# EAGLE board F6779 Ver 2.1 (EAGLE 7.7.0), part 1 of 2
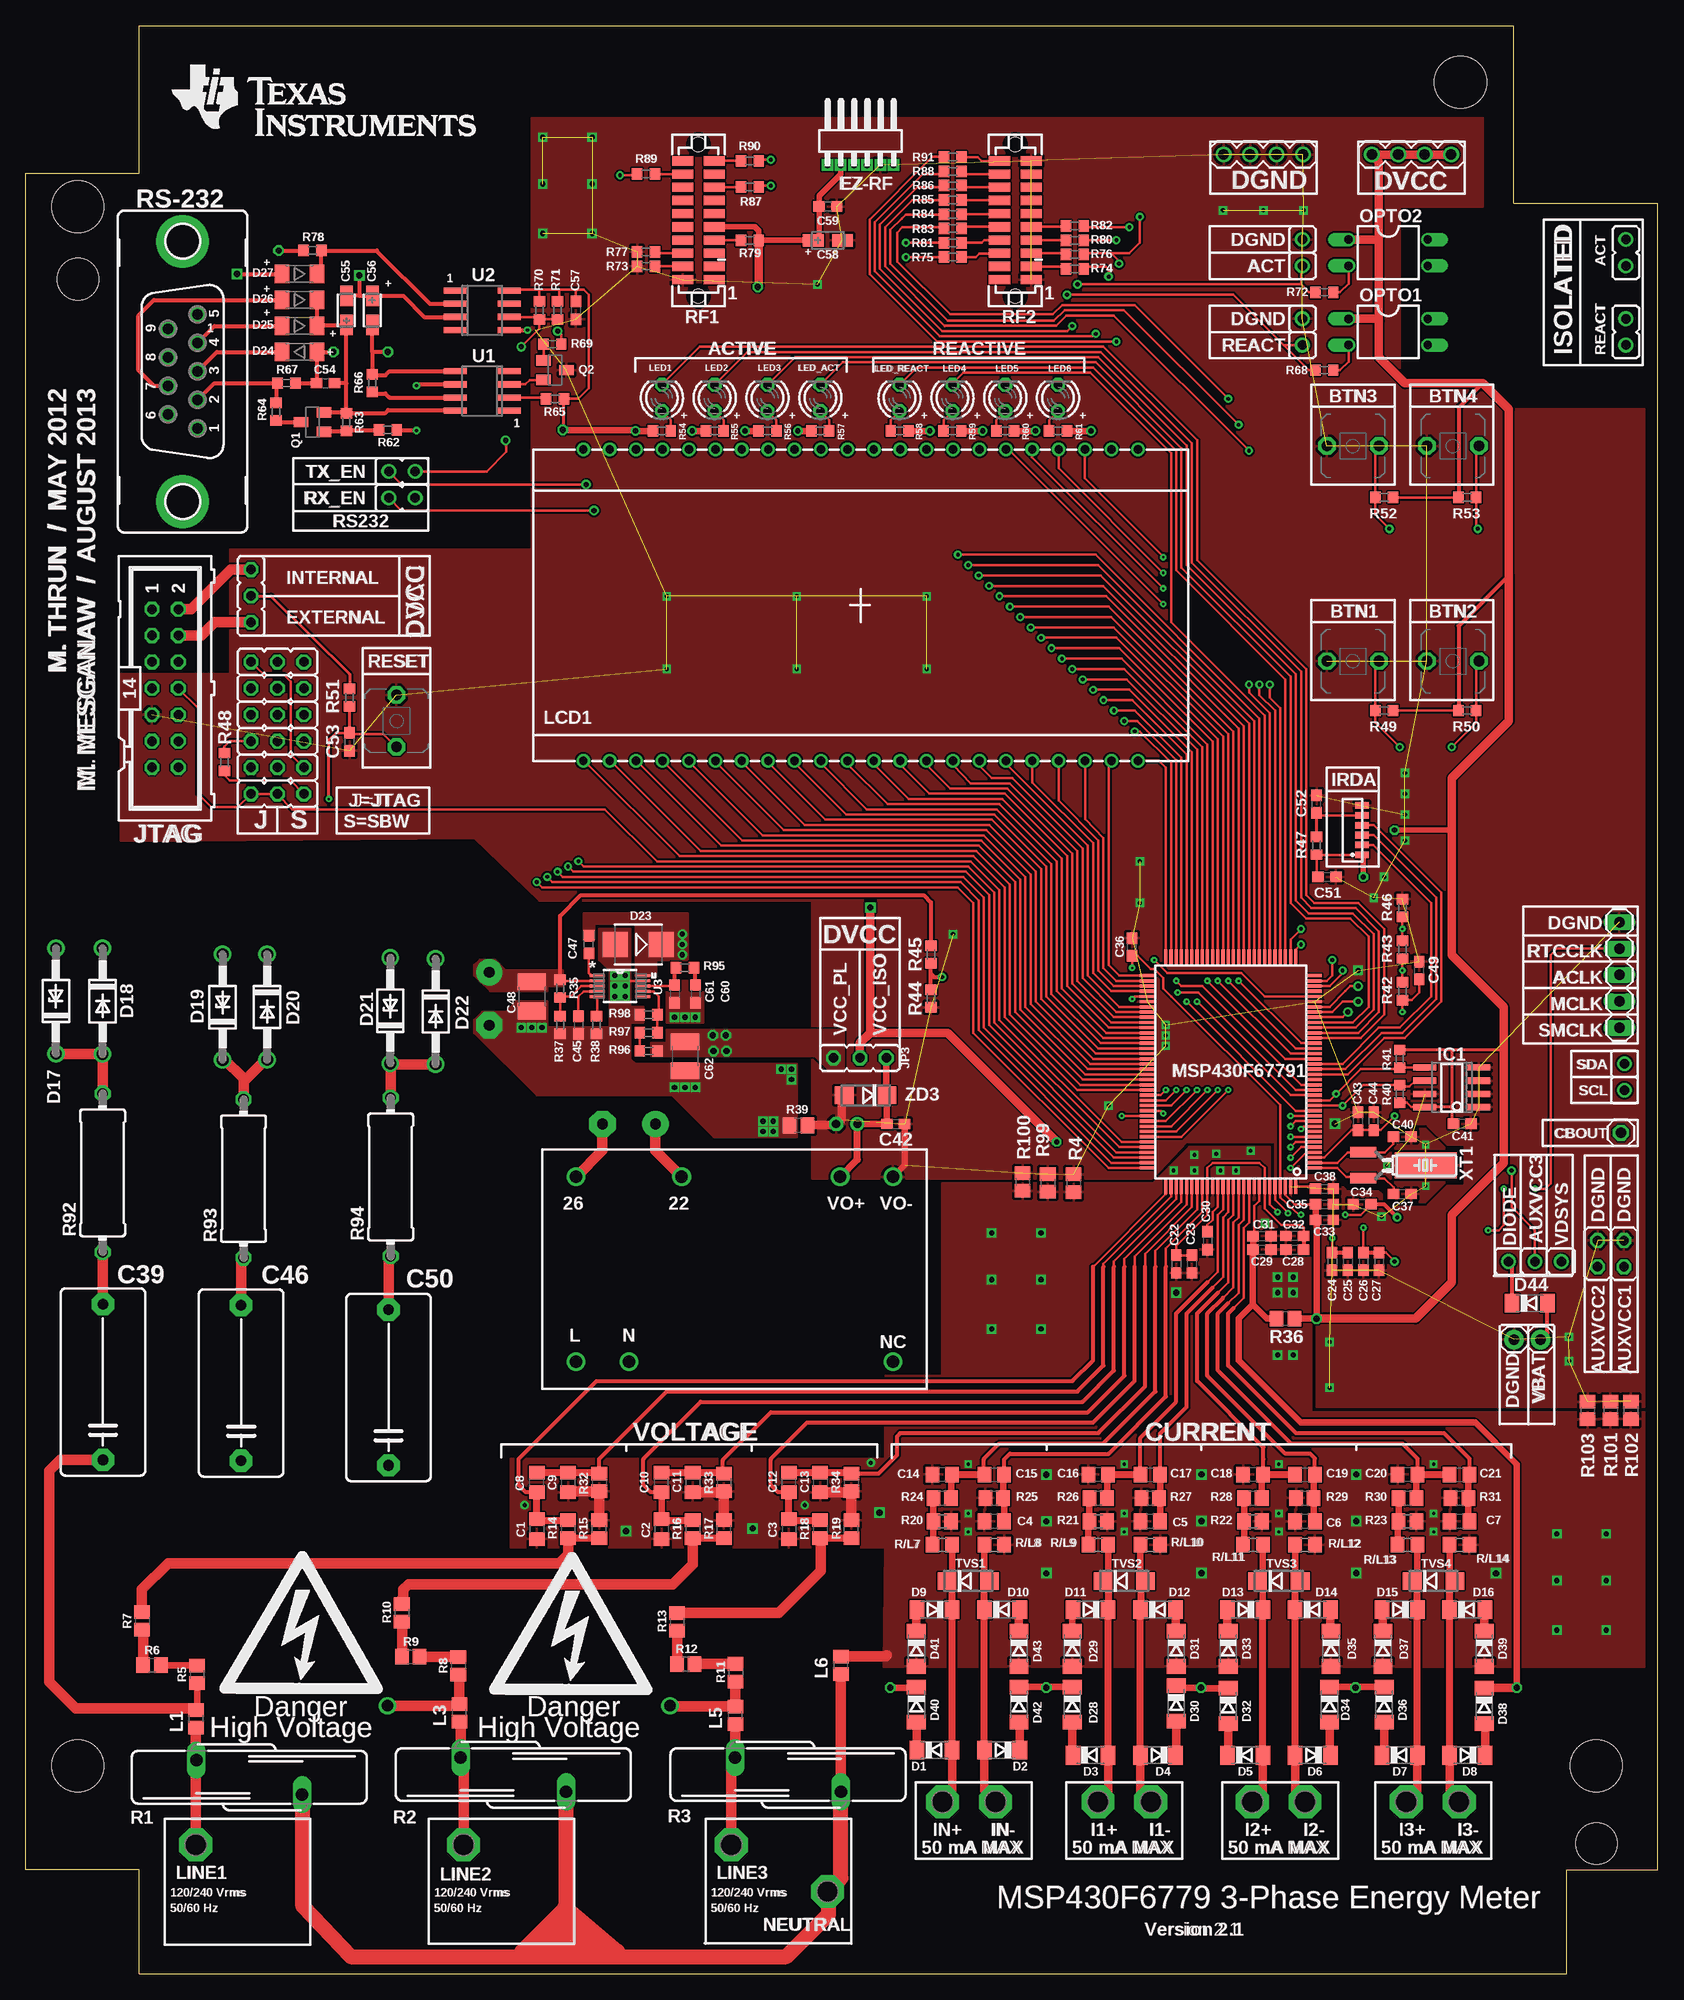
[diagram p4: board, top side]
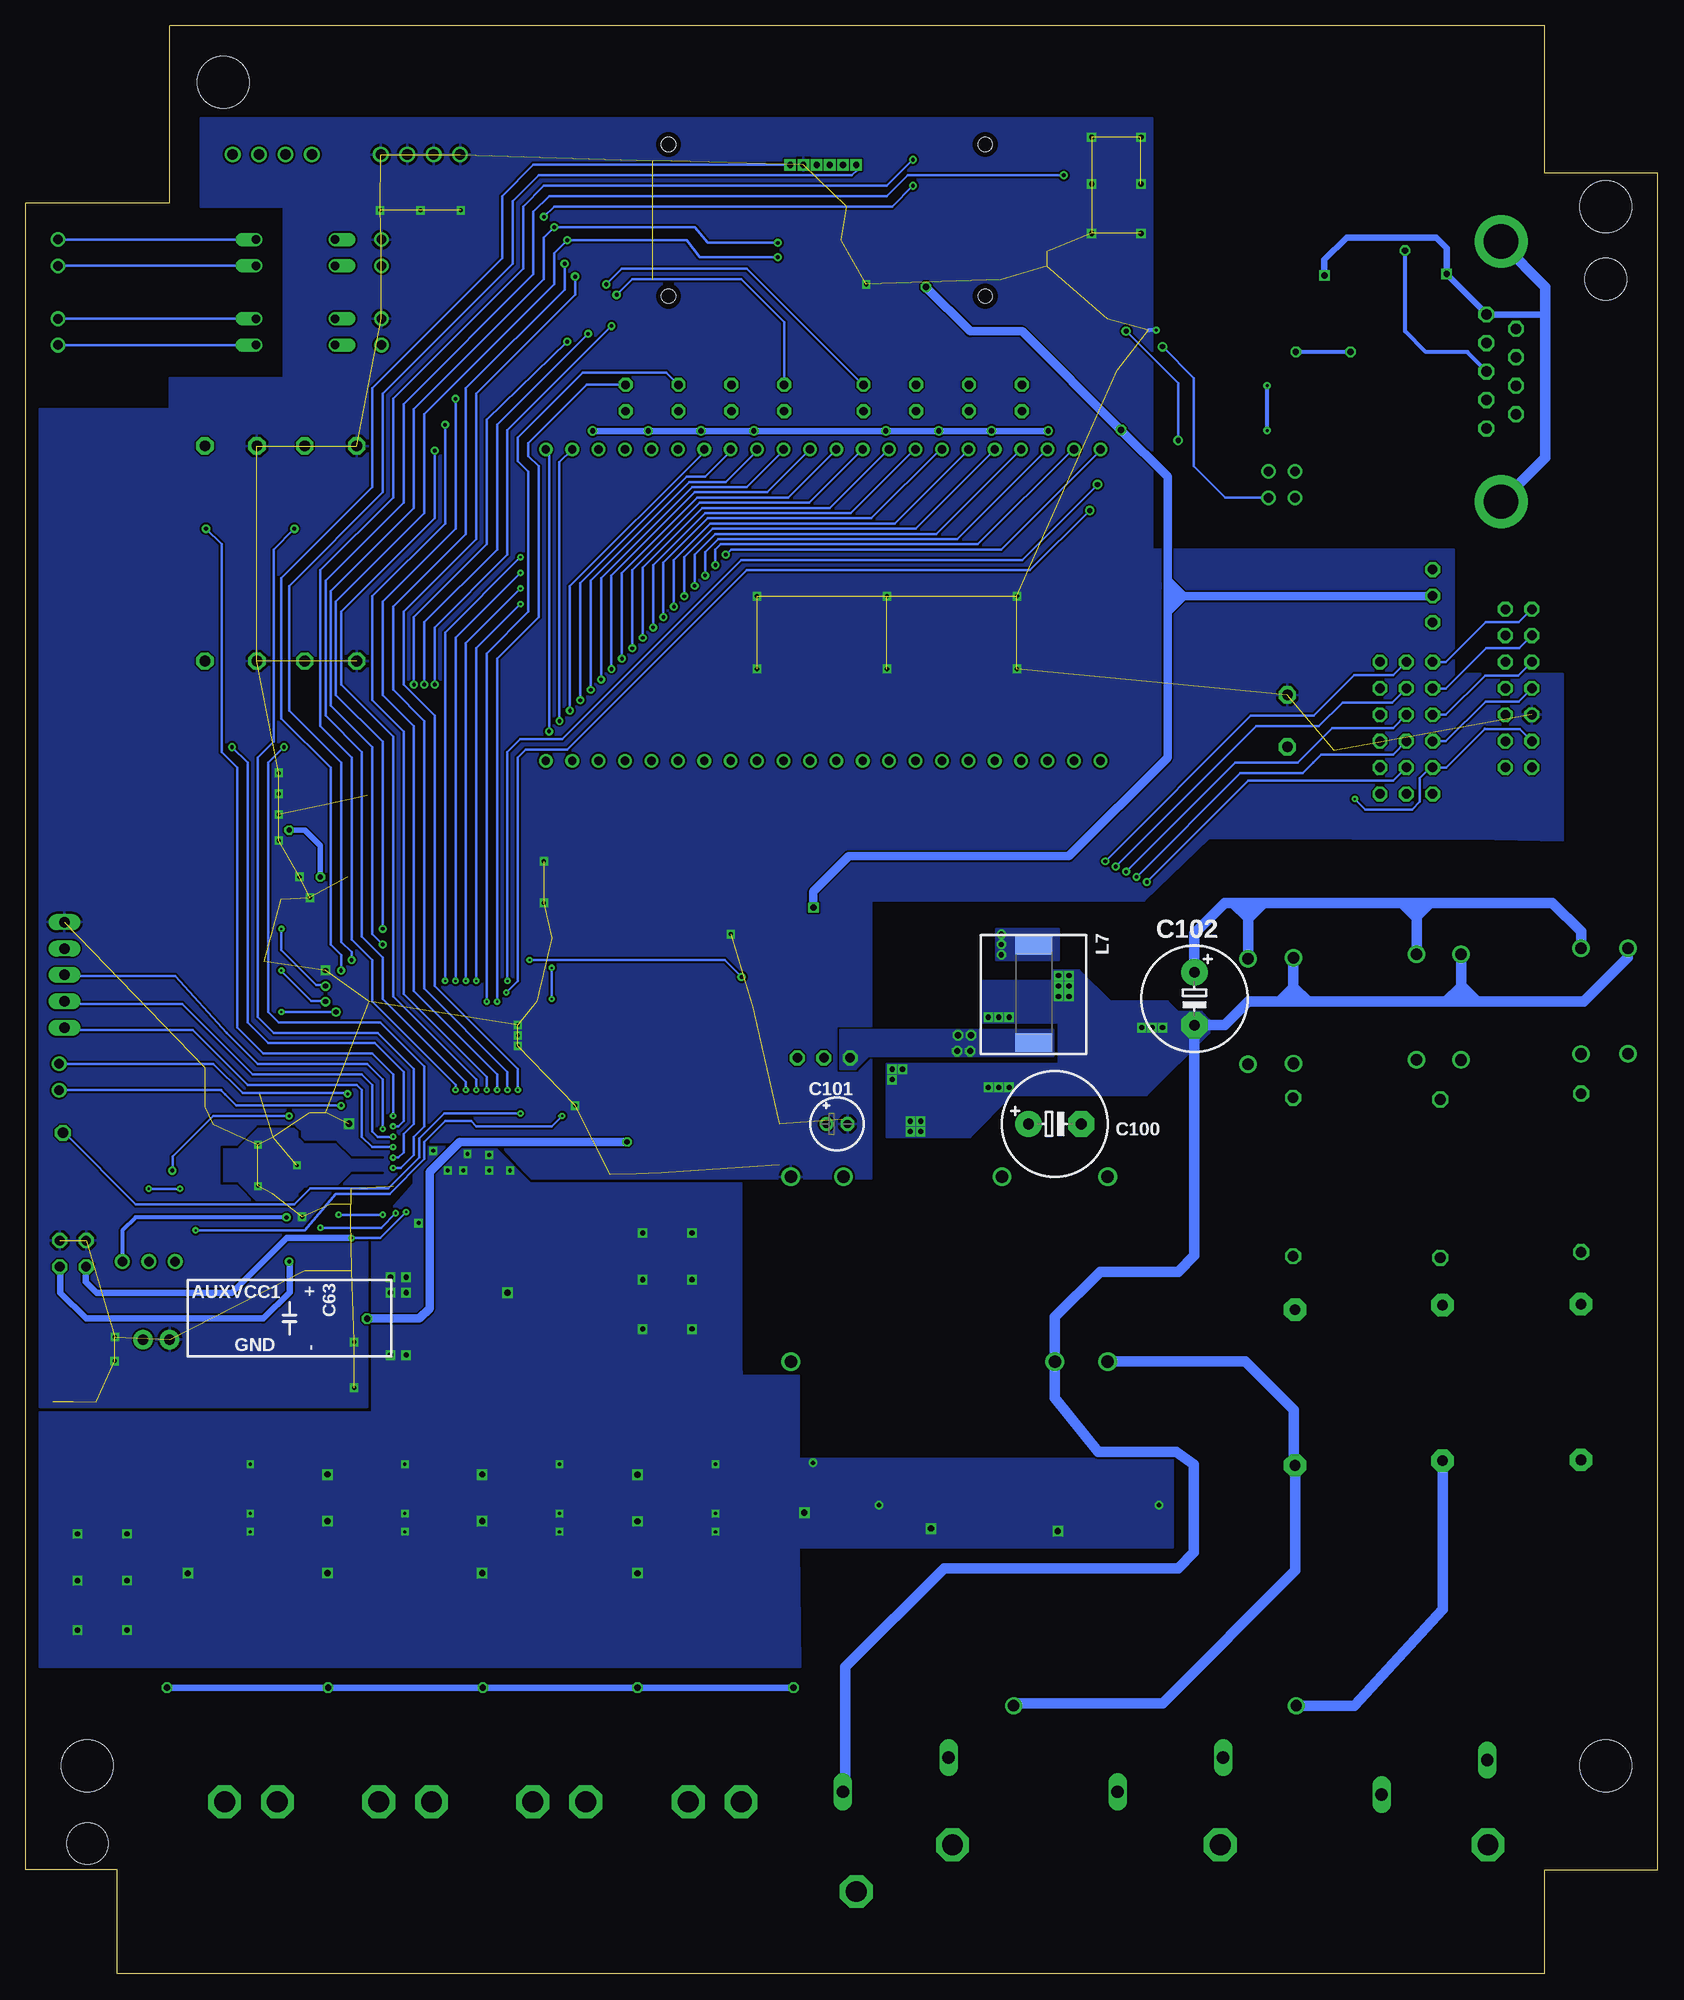
[diagram p5: board, bottom side, seen from below]

Size 156.94 x 187.36 mm. Coordinates in mm from the lower left corner, seen from the top.
Outline: 148.18,0 148.18,10 156.94,10 156.94,170.29 143.1,170.29 143.1,187.36 10.88,187.36 10.88,173.2 0,173.2 0,10 10.88,10 10.88,0 148.18,0
Copper layers (1*16): Top 0.0356mm / dielectric 1.5011mm / Bottom 0.0356mm
Design rules "SilverCircuits *": minimum track width 7mil, minimum drill 7.5mil, track to track 7mil, track to pad 7mil, pad to pad 7mil, via to via 7mil, smd to smd 0mil, copper to edge 20mil, drill to drill 8mil, minimum pad ring 10mil, minimum via ring 8mil, stop-mask expansion 4mil, vias tented up to drill 17mil, thermal gap 10mil
Holes 5 mm at 137.97,181.95 5,169.99 5,20 151.04,20
Holes 4 mm at 5,163 151.04,12.5
tRestrict: 20 lines
bRestrict: 19 lines

## Footprints (pad centres in the part's own frame; a part is rotated, then mirrored left to right if it is on the bottom)
JP1 = drill 0.914: 1 0,-1.27; 2 0,1.27
JP2 = drill 0.914: 1 -2.54,0; 2 0,0; 3 2.54,0
PBTH = drill 1.016 pad 1.676 octagon: 1 -0.001,0.001; 2 5.001,0.001
C0805 = smd 1.3 x 1.5: 1 -0.95,0; 2 0.95,0
C0603 = smd 1.1 x 1: 1 -0.85,0; 2 0.85,0
C15B8 = drill 1.016 pad 2.159 octagon: 1 -7.493,0; 2 7.493,0
C1210 = smd 1.6 x 2.7: 1 -1.4,0; 2 1.4,0
CT3216 = smd 2 x 1.2: + 1.4,0; - -1.4,0
CT3216' = smd 2 x 1.2: + -1.4,0; - 1.4,0
E5-10,5 = drill 1.016 pad 2.54: + -2.54,0 | drill 1.016 pad 2.54 octagon: - 2.54,0
E2-5 = drill 0.813 pad 1.27: + -1.016,0 | drill 0.813 pad 1.27 octagon: - 1.016,0
SOD80C = smd 1.4 x 1.8: A 1.7,0; C -1.7,0
DO41Z10 = drill 1.118: A 5.08,0; C -5.08,0
DO41-10 = drill 1.118: A 5.08,0; C -5.08,0
SMB = smd 2.4 x 2.4: A 2.2,0; C -2.2,0
SOD80 = smd 1.4 x 1.8: 1 -1.7,0; 2 1.7,0
MA04-1 = drill 1.016: 1 -3.81,0; 2 -1.27,0; 3 1.27,0; 4 3.81,0
SL127L6_MPE = drill 0.6 pad 0.889 square: 1 -3.17,0.07; 2 -1.91,0.07; 3 -0.63,0.07; 4 0.63,0.07; 5 1.91,0.07; 6 3.18,0.07
1X02 = drill 1.016 pad 1.88: 1 0,0; 2 2.54,0
P1-20 = drill 2.007 pad 3.15 octagon: TP 0,0
SO-08 = smd 0.6 x 2.2: 1 -1.905,-2.6; 2 -0.635,-2.6; 3 0.635,-2.6; 4 1.905,-2.6; 5 1.905,2.6; 6 0.635,2.6; 7 -0.635,2.6; 8 -1.905,2.6
TFBS4711 = smd 0.64 x 1.27: P$1 0.625,0.635; P$2 1.575,0.635; P$3 2.525,0.635; P$4 3.475,0.635; P$5 4.425,0.635; P$6 5.375,0.635
JP2' = drill 0.914 octagon: 1 -2.54,0; 2 0,0; 3 2.54,0
1X01 = drill 1.016 octagon: 1 0,0
ML14 = drill 0.914 octagon: 1 -7.62,-1.27; 2 -7.62,1.27; 3 -5.08,-1.27; 4 -5.08,1.27; 5 -2.54,-1.27; 6 -2.54,1.27; 7 0,-1.27; 8 0,1.27; 9 2.54,-1.27; 10 2.54,1.27; 11 5.08,-1.27; 12 5.08,1.27; 13 7.62,-1.27; 14 7.62,1.27
R0805 = smd 1.3 x 1.5: 1 -0.85,0; 2 0.85,0
INDUCTOR_POWER_SUPPLY_6779 = smd 3.556 x 1.778: 1 -3.81,-4.64; 2 -3.81,4.758
TI_160SEG_LCD = drill 0.8: 1 4.826,0; 2 7.366,0; 3 9.906,0; 4 12.446,0; 5 14.986,0; 6 17.526,0; 7 20.066,0; 8 22.606,0; 9 25.146,0; 10 27.686,0; 11 30.226,0; 12 32.766,0; 13 35.306,0; 14 37.846,0; 15 40.386,0; 16 42.926,0; 17 45.466,0; 18 48.006,0; 19 50.546,0; 20 53.086,0; 21 55.626,0; 22 58.166,0; 23 58.166,29.972; 24 55.626,29.972; 29 42.926,29.972; 30 40.386,29.972; 31 37.846,29.972; 32 35.306,29.972; 33 32.766,29.972; 34 30.226,29.972; 35 27.686,29.972; 36 25.146,29.972; 37 22.606,29.972; 38 20.066,29.972; 39 17.526,29.972; 40 14.986,29.972; 41 12.446,29.972; 42 9.906,29.972; 43 7.366,29.972; 44 4.826,29.972; COM0 45.466,29.972; COM1 48.006,29.972; COM2 50.546,29.972; COM3 53.086,29.972
LED3MM = drill 0.813 octagon: A -1.27,0; K 1.27,0
PEU128 = smd 0.3 x 1.4: 1 -9,-7.8; 2 -8.5,-7.8; 3 -8,-7.8; 4 -7.5,-7.8; 5 -7,-7.8; 6 -6.5,-7.8; 7 -6,-7.8; 8 -5.5,-7.8; 9 -5,-7.8; 10 -4.5,-7.8; 11 -4,-7.8; 12 -3.5,-7.8; 13 -3,-7.8; 14 -2.5,-7.8; 15 -2,-7.8; 16 -1.5,-7.8; 17 -1,-7.8; 18 -0.5,-7.8; 19 0,-7.8; 20 0.5,-7.8; 21 1,-7.8; 22 1.5,-7.8; 23 2,-7.8; 24 2.5,-7.8; 25 3,-7.8; 26 3.5,-7.8; 27 4,-7.8; 28 4.5,-7.8; 29 5,-7.8; 30 5.5,-7.8; 31 6,-7.8; 32 6.5,-7.8; 33 7,-7.8; 34 7.5,-7.8; 35 8,-7.8; 36 8.5,-7.8; 37 9,-7.8; 38 9.5,-7.8; 65 9.5,8.3; 66 9,8.3; 67 8.5,8.3; 68 8,8.3; 69 7.5,8.3; 70 7,8.3; 71 6.5,8.3; 72 6,8.3; 73 5.5,8.3; 74 5,8.3; 75 4.5,8.3; 76 4,8.3; 77 3.5,8.3; 78 3,8.3; 79 2.5,8.3; 80 2,8.3; 81 1.5,8.3; 82 1,8.3; 83 0.5,8.3; 84 0,8.3; 85 -0.5,8.3; 86 -1,8.3; 87 -1.5,8.3; 88 -2,8.3; 89 -2.5,8.3; 90 -3,8.3; 91 -3.5,8.3; 92 -4,8.3; 93 -4.5,8.3; 94 -5,8.3; 95 -5.5,8.3; 96 -6,8.3; 97 -6.5,8.3; 98 -7,8.3; 99 -7.5,8.3; 100 -8,8.3; 101 -8.5,8.3; 102 -9,8.3 | smd 1.4 x 0.3: 39 11.3,-6; 40 11.3,-5.5; 41 11.3,-5; 42 11.3,-4.5; 43 11.3,-4; 44 11.3,-3.5; 45 11.3,-3; 46 11.3,-2.5; 47 11.3,-2; 48 11.3,-1.5; 49 11.3,-1; 50 11.3,-0.5; 51 11.3,0; 52 11.3,0.5; 53 11.3,1; 54 11.3,1.5; 55 11.3,2; 56 11.3,2.5; 57 11.3,3; 58 11.3,3.5; 59 11.3,4; 60 11.3,4.5; 61 11.3,5; 62 11.3,5.5; 63 11.3,6; 64 11.3,6.5; 103 -10.8,6.5; 104 -10.8,6; 105 -10.8,5.5; 106 -10.8,5; 107 -10.8,4.5; 108 -10.8,4; 109 -10.8,3.5; 110 -10.8,3; 111 -10.8,2.5; 112 -10.8,2; 113 -10.8,1.5; 114 -10.8,1; 115 -10.8,0.5; 116 -10.8,0; 117 -10.8,-0.5; 118 -10.8,-1; 119 -10.8,-1.5; 120 -10.8,-2; 121 -10.8,-2.5; 122 -10.8,-3; 123 -10.8,-3.5; 124 -10.8,-4; 125 -10.8,-4.5; 126 -10.8,-5; 127 -10.8,-5.5; 128 -10.8,-6
DIL04 = drill 0.813 offset: 1 -1.27,-3.81; 2 1.27,-3.81; 3 1.27,3.81; 4 -1.27,3.81
SOT23-BEC = smd 1 x 1.4: B -0.95,-1.1; C 0,1.1; E 0.95,-1.1
S20K275 = drill 1.194 long: 1 -1.651,-5.08; 2 1.651,5.08
R0603 = smd 1 x 1.1: 1 -0.85,0; 2 0.85,0
0414/15 = drill 1.016 octagon: 1 -7.62,0; 2 7.62,0
R0805' = smd 1.3 x 1.5: 1 -0.95,0; 2 0.95,0
TFM-110-02-SM-D-A-K = smd 2.032 x 0.889: 1 -1.524,5.715; 2 1.524,5.715; 3 -1.524,4.445; 4 1.524,4.445; 5 -1.524,3.175; 6 1.524,3.175; 7 -1.524,1.905; 8 1.524,1.905; 9 -1.524,0.635; 10 1.524,0.635; 11 -1.524,-0.635; 12 1.524,-0.635; 13 -1.524,-1.905; 14 1.524,-1.905; 15 -1.524,-3.175; 16 1.524,-3.175; 17 -1.524,-4.445; 18 1.524,-4.445; 19 -1.524,-5.715; 20 1.524,-5.715 | hole 1.359: 0,7.303; 0,-7.303
F09VP = drill 1.016 octagon: 1 5.486,1.422; 2 2.743,1.422; 3 0,1.422; 4 -2.743,1.422; 5 -5.486,1.422; 6 4.115,-1.422; 7 1.372,-1.422; 8 -1.372,-1.422; 9 -4.115,-1.422 | drill 3.302 pad 5.08: G1 -12.522,0; G2 12.522,0
JP2Q = drill 0.914 octagon: 1 -1.27,-1.27; 2 -1.27,1.27; 3 1.27,-1.27; 4 1.27,1.27
MA05-1 = drill 1.016 long: 1 -5.08,0; 2 -2.54,0; 3 0,0; 4 2.54,0; 5 5.08,0
DO214AC = smd 1.8 x 1.7: A 2.05,0; C -2.05,0
SO08 = smd 0.6 x 2.2: 1 -1.905,-2.6; 2 -0.635,-2.6; 3 0.635,-2.6; 4 1.905,-2.6; 5 1.905,2.6; 6 0.635,2.6; 7 -0.635,2.6; 8 -1.905,2.6
DGQ10_1P88X1P57 = smd 1.422 x 0.279: 1 -2.184,0.991; 2 -2.184,0.508; 3 -2.184,0; 4 -2.184,-0.508; 5 -2.184,-0.991; 6 2.184,-0.991; 7 2.184,-0.508; 8 2.184,0; 9 2.184,0.508; 10 2.184,0.991
CUI_XR = drill 1.2: 22 10.16,0; 26 0,0; L 0,-17.78; N 5.08,-17.78; NC 30.48,-17.78; VO+ 25.4,0; VO- 30.48,0
CM200T = smd 1 x 2.5: P1 -1.25,-5; P2 1.25,-5 | smd 2.5 x 6: P3 0,1

## Placement (x,y rotation side)
ACT  [JP1]  153.87,165.55 0 top
AUXVCC3  [JP2]  145.13,68.5 0 top
BTN1  [PBTH]  125.13,126.26 0 top
BTN2  [PBTH]  134.74,126.26 0 top
BTN3  [PBTH]  125.13,146.96 0 top
BTN4  [PBTH]  134.74,146.96 0 top
C1  47p  [C0805]  49.13,42.75 270 top
C2  47p  [C0805]  61.13,42.75 270 top
C3  47p  [C0805]  73.38,42.75 270 top
C4  47p  [C0805]  93.13,43.5 180 top
C5  47p  [C0805]  108.13,43.5 180 top
C6  47p  [C0805]  123.01,43.5 180 top
C7  47p  [C0805]  137.88,43.5 180 top
C8  15n  [C0805]  49.13,47.25 90 top
C9  47p  [C0805]  52.13,47.25 270 top
C10  15n  [C0805]  61.13,47.25 90 top
C11  47p  [C0805]  64.13,47.25 270 top
C12  15n  [C0805]  73.38,47.25 90 top
C13  47p  [C0805]  76.38,47.25 270 top
C14  47p  [C0805]  88.13,48 180 top
C15  15n  [C0805]  93.13,48 0 top
C16  47p  [C0805]  103.13,48 180 top
C17  15n  [C0805]  108.13,48 0 top
C18  47p  [C0805]  118.01,48 180 top
C19  15n  [C0805]  123.01,48 0 top
C20  47p  [C0805]  132.88,48 180 top
C21  15n  [C0805]  137.88,48 0 top
C22  4.7uF  [C0603]  110.63,68.25 270 top
C23  100nF  [C0603]  112.13,68.25 270 top
C24  4.7uF  [C0603]  125.63,68.5 270 top
C25  100nF  [C0603]  127.13,68.5 270 top
C26  4.7uF  [C0603]  128.63,68.5 270 top
C27  100nF  [C0603]  130.13,68.5 270 top
C28  100nF  [C0603]  122.03,69.62 180 top
C29  4.7uF  [C0603]  118.88,69.65 0 top
C30  100nF  [C0603]  113.63,70.5 270 top
C31  100nF  [C0603]  118.88,70.95 0 top
C32  4.7uF  [C0603]  122.02,70.96 180 top
C33  100nF  [C0603]  124.88,72.5 0 top
C34  4.7uF  [C0603]  128.51,74 180 top
C35  4.7uF  [C0603]  124.88,74 0 top
C36  100nF  [C0603]  106.38,98.75 90 top
C37  12pF  [C0603]  132.38,75 0 top
C38  0.47uF  [C0603]  124.88,75.5 0 top
C39  0.22uF/305VAC  [C15B8]  7.4,56.91 90 top
C40  12pF  [C0603]  132.38,80.5 0 top
C41  0.1uF  [C0603]  138.13,81.75 180 top
C42  0.1uF  [C0603]  83.66,81.73 0 top
C43  100nF  [C0603]  128.13,82 90 top
C44  0.47uF  [C0603]  129.63,82 90 top
C45  0.01uF  [C0603]  53.13,91.25 270 top
C46  0.22uF/305VAC  [C15B8]  20.69,56.81 90 top
C47  0.1uF  [C0603]  54.13,99 90 top
C48  2.2uF  [C1210]  48.63,94 270 top
C49  4.7uF  [C0603]  134.01,96.5 90 top
C50  0.22uF/305VAC  [C15B8]  34.87,56.38 90 top
C51  4.7uF  [C0603]  125.13,105.5 0 top
C52  0.1uF  [C0603]  124.13,112.5 90 top
C53  0.1uF  [C0603]  31.13,118.5 90 top
C54  0.1uF  [C0603]  28.81,153 0 top
C55  10uF  [CT3216]  30.81,160 270 top
C56  10uF  [CT3216]  33.31,160 90 top
C57  0.1uF  [C0603]  52.88,160 270 top
C58  10uF  [CT3216']  77.13,166.75 0 top
C59  0.1uF  [C0603]  77.13,170 180 top
C60  .056uF  [C0603]  64.38,94.25 270 top
C61  100pF  [C0603]  62.38,94.25 270 top
C62  47uF  [C1210]  63.38,88.25 270 top
C100  4.7u/400V  [E5-10,5]  57.99,81.73 0 bottom
C101  150uF  [E2-5]  78.94,81.73 0 bottom
C102  100uF/100V  [E5-10,5]  44.56,93.78 270 bottom
D1  PMLL4148  [SOD80C]  87.38,21.5 0 top
D2  PMLL4148  [SOD80C]  93.88,21.5 180 top
D3  PMLL4148  [SOD80C]  102.38,21 0 top
D4  PMLL4148  [SOD80C]  108.88,21 180 top
D5  PMLL4148  [SOD80C]  117.26,21 0 top
D6  PMLL4148  [SOD80C]  123.76,21 180 top
D7  PMLL4148  [SOD80C]  132.13,21 0 top
D8  PMLL4148  [SOD80C]  138.63,21 180 top
D9  PMLL4148  [SOD80C]  87.38,35 180 top
D10  PMLL4148  [SOD80C]  93.88,35 0 top
D11  PMLL4148  [SOD80C]  102.38,35 180 top
D12  PMLL4148  [SOD80C]  108.88,35 0 top
D13  PMLL4148  [SOD80C]  117.26,35 180 top
D14  PMLL4148  [SOD80C]  123.76,35 0 top
D15  PMLL4148  [SOD80C]  132.13,35 180 top
D16  PMLL4148  [SOD80C]  138.63,35 0 top
D17  1N4757A  [DO41Z10]  2.87,93.57 90 top
D18  1N4007  [DO41-10]  7.37,93.54 270 top
D19  1N4757A  [DO41Z10]  18.92,92.97 90 top
D20  1N4007  [DO41-10]  23.2,92.99 270 top
D21  1N4757A  [DO41Z10]  35.04,92.63 90 top
D22  1N4007  [DO41-10]  39.41,92.54 270 top
D23  B160  [SMB]  58.88,99 180 top
D24  LL103A  [SOD80]  26.31,156 0 top
D25  LL103A  [SOD80]  26.31,158.5 180 top
D26  LL103A  [SOD80]  26.31,161 180 top
D27  LL103A  [SOD80]  26.31,163.5 180 top
D28  PMLL4148  [SOD80C]  100.63,25.88 270 top
D29  PMLL4148  [SOD80C]  100.63,31.25 270 top
D30  PMLL4148  [SOD80C]  110.63,26 270 top
D31  PMLL4148  [SOD80C]  110.63,31.25 270 top
D32  PMLL4148  [SOD80C]  115.63,25.75 270 top
D33  PMLL4148  [SOD80C]  115.63,31.25 270 top
D34  PMLL4148  [SOD80C]  125.38,25.88 270 top
D35  PMLL4148  [SOD80C]  125.51,31.25 270 top
D36  PMLL4148  [SOD80C]  130.63,25.88 270 top
D37  PMLL4148  [SOD80C]  130.51,31.25 270 top
D38  PMLL4148  [SOD80C]  140.26,25.75 270 top
D39  PMLL4148  [SOD80C]  140.26,31.25 270 top
D40  PMLL4148  [SOD80C]  85.63,25.88 270 top
D41  PMLL4148  [SOD80C]  85.63,31.25 270 top
D42  PMLL4148  [SOD80C]  95.51,25.88 270 top
D43  PMLL4148  [SOD80C]  95.51,31.25 270 top
D44  [SOD80C]  144.63,64.5 0 top
DGND  [MA04-1]  119.01,175 0 top
DVCC  [MA04-1]  133.26,175 0 top
EZ-RF  SL127L6TH  [SL127L6_MPE]  80.27,173.93 0 top
HD1  [1X02]  143.13,61 0 top
I1+  TPPAD1-20  [P1-20]  103.11,16.52 90 top
I1-  TPPAD1-20  [P1-20]  108.19,16.52 90 top
I2+  TPPAD1-20  [P1-20]  117.94,16.52 90 top
I2-  TPPAD1-20  [P1-20]  123.02,16.52 90 top
I3+  TPPAD1-20  [P1-20]  132.76,16.52 90 top
I3-  TPPAD1-20  [P1-20]  137.84,16.52 90 top
IC1  24C02CSN  [SO-08]  137.13,85.25 90 top
IN+  TPPAD1-20  [P1-20]  88.16,16.52 90 top
IN-  TPPAD1-20  [P1-20]  93.24,16.52 90 top
IRDA  TFBS4711-TT1  [TFBS4711]  129.13,107 90 top
JP2  [JP1]  153.75,86.25 0 top
JP3  [JP2']  80.21,88.08 180 top
JP4  [JP2']  24.18,113.48 180 top
JP5  [JP2']  24.18,116.02 180 top
JP6  [JP2']  24.18,118.56 180 top
JP7  [JP2']  24.18,121.1 180 top
JP8  [JP2']  24.18,123.64 180 top
JP9  [JP2']  24.18,126.18 180 top
JP10  [JP2']  21.64,132.53 270 top
JP11  [JP1]  122.76,157.93 0 top
JP12  [JP1]  122.76,165.55 0 top
JP13  [1X01]  153.4,80.88 0 top
JTAG  [ML14]  13.39,123.64 270 top
L1  EXCML20A  [R0805]  16.37,24.5 90 top
L3  EXCML20A  [R0805]  41.69,25.09 90 top
L5  EXCML20A  [R0805]  68.23,24.83 90 top
L6  EXCML20A  [R0805]  78.39,29.66 90 top
L7  1mH  [INDUCTOR_POWER_SUPPLY_6779]  63.84,94.3 180 bottom
LCD1  TI_160SEG_LCD  [TI_160SEG_LCD]  48.78,116.66 0 top
LED1  [LED3MM]  61.16,151.58 90 top
LED2  [LED3MM]  66.24,151.58 90 top
LED3  [LED3MM]  71.32,151.58 90 top
LED4  [LED3MM]  89.1,151.58 90 top
LED5  [LED3MM]  94.18,151.58 90 top
LED6  [LED3MM]  99.26,151.58 90 top
LED_ACT  [LED3MM]  76.4,151.58 90 top
LED_REACT  [LED3MM]  84.02,151.58 90 top
LINE1  TPPAD1-20  [P1-20]  16.33,12.38 90 top
LINE2  TPPAD1-20  [P1-20]  42.08,12.38 90 top
LINE3  TPPAD1-20  [P1-20]  67.83,12.38 90 top
MSP430F67791  MSP430F6779IPEU  [PEU128]  116.13,86.5 90 top
NEUTRAL  TPPAD1-20  [P1-20]  77.08,7.88 90 top
OPTO1  TIL191  [DIL04]  131.01,157.93 270 top
OPTO2  TIL191  [DIL04]  131.01,165.55 270 top
Q1  BC857BSMD  [SOT23-BEC]  27.56,149.25 90 top
Q2  BC857BSMD  [SOT23-BEC]  50.88,154.25 270 top
R1  S20K275  [S20K275]  21.48,18.88 90 top
R2  S20K275  [S20K275]  46.88,19.14 90 top
R3  S20K275  [S20K275]  73.29,19.14 90 top
R4  0  [R0805]  100.76,76.03 270 top
R5  330k  [R0805]  16.44,28.78 270 top
R6  330k  [R0805]  12.12,29.66 0 top
R7  330k  [R0805]  11.17,33.92 270 top
R8  330k  [R0805]  41.57,29.61 270 top
R9  330k  [R0805]  37.02,30.49 0 top
R10  330k  [R0805]  36.14,34.69 270 top
R11  330k  [R0805]  68.26,28.94 270 top
R12  330k  [R0805]  63.47,29.79 0 top
R13  330k  [R0805]  62.62,33.83 270 top
R14  1k  [R0805]  52.13,42.75 270 top
R15  2.37K  [R0805]  55.13,42.75 90 top
R16  1k  [R0805]  64.13,42.75 270 top
R17  2.37K  [R0805]  67.13,42.75 90 top
R18  1k  [R0805]  76.38,42.75 270 top
R19  2.37K  [R0805]  79.38,42.75 90 top
R20  12.4  [R0805]  88.13,43.5 180 top
R21  12.4  [R0805]  103.13,43.5 180 top
R22  12.4  [R0805]  118.01,43.5 180 top
R23  12.4  [R0805]  132.88,43.5 180 top
R24  1k  [R0805]  88.13,45.75 0 top
R25  1k  [R0805]  93.13,45.75 0 top
R26  1k  [R0805]  103.13,45.75 0 top
R27  1k  [R0805]  108.13,45.75 0 top
R28  1k  [R0805]  118.01,45.75 0 top
R29  1k  [R0805]  123.01,45.75 0 top
R30  1k  [R0805]  132.88,45.75 0 top
R31  1k  [R0805]  137.88,45.75 0 top
R32  1k  [R0805]  55.13,47.25 270 top
R33  1k  [R0805]  67.13,47.25 270 top
R34  1k  [R0805]  79.38,47.25 270 top
R35  1M  [R0603]  51.38,94.75 90 top
R36  10R  [R0805]  121.14,63.01 180 top
R37  33.2K  [R0603]  51.38,91.25 90 top
R38  1M  [R0603]  54.88,91.25 90 top
R39  0  [R0805]  74.3,81.59 180 top
R40  10k  [R0603]  132.13,84.62 270 top
R41  10k  [R0603]  132.13,88 90 top
R42  560k  [R0603]  132.38,94.5 270 top
R43  560k  [R0603]  132.38,98.5 270 top
R44  DNP  [R0603]  87.03,93.79 90 top
R45  DNP  [R0603]  87.03,98.04 90 top
R46  560k  [R0603]  132.38,102.5 270 top
R47  47  [R0603]  124.13,108.5 90 top
R48  330  [R0603]  19.07,116.56 270 top
R49  100K  [R0603]  130.63,121.5 180 top
R50  100K  [R0603]  138.63,121.5 0 top
R51  47K  [R0603]  31.13,122.75 270 top
R52  100K  [R0603]  130.63,142 180 top
R53  100K  [R0603]  138.63,142 0 top
R54  100  [R0603]  61.16,148.41 0 top
R55  100  [R0603]  66.24,148.41 0 top
R56  100  [R0603]  71.32,148.41 0 top
R57  100  [R0603]  76.4,148.41 0 top
R58  100  [R0603]  84.02,148.41 180 top
R59  100  [R0603]  89.1,148.41 180 top
R60  100  [R0603]  94.18,148.41 180 top
R61  100  [R0603]  99.26,148.41 180 top
R62  1k  [R0603]  34.81,148.5 180 top
R63  10k  [R0603]  30.81,149.25 90 top
R64  220  [R0603]  24.06,150.25 270 top
R65  68  [R0603]  50.88,151.5 180 top
R66  DNP  [R0603]  33.31,153 90 top
R67  1.5k  [R0603]  25.06,153 180 top
R68  1k  [R0603]  124.88,154.25 0 top
R69  2.2k  [R0603]  50.63,156.75 180 top
R70  DNP  [R0603]  49.38,160 90 top
R71  2.2k  [R0603]  51.13,160 270 top
R72  1k  [R0603]  124.88,161.75 0 top
R73  0  [R0603]  59.63,164.25 180 top
R74  0  [R0603]  100.88,164 180 top
R75  0  [R0603]  89.13,165.12 180 top
R76  0  [R0603]  100.88,165.38 180 top
R77  0  [R0603]  59.63,165.62 180 top
R78  1k  [R0603]  27.56,165.75 180 top
R79  0  [R0603]  69.63,166.75 180 top
R80  0  [R0603]  100.88,166.75 180 top
R81  0  [R0603]  89.13,166.5 180 top
R82  0  [R0603]  100.88,168.12 180 top
R83  0  [R0603]  89.13,167.88 180 top
R84  0  [R0603]  89.13,169.25 180 top
R85  0  [R0603]  89.13,170.62 180 top
R86  0  [R0603]  89.13,172 180 top
R87  0  [R0603]  69.63,171.88 180 top
R88  0  [R0603]  89.13,173.38 180 top
R89  0  [R0603]  59.63,173.12 180 top
R90  0  [R0603]  69.63,174.38 180 top
R91  0  [R0603]  89.13,174.75 180 top
R92  100  [0414/15]  7.37,77.03 90 top
R93  100  [0414/15]  20.92,76.47 90 top
R94  100  [0414/15]  35.07,76.63 90 top
R95  22.1k  [R0603]  63.38,96.75 180 top
R96  51.1  [R0603]  59.88,88.75 0 top
R97  31.6k  [R0603]  59.88,90.5 180 top
R98  10k  [R0603]  59.88,92.25 0 top
R99  0  [R0805]  98.27,76.06 270 top
R100  0  [R0805]  95.86,76.16 270 top
R101  0  [R0805]  152.4,54.19 270 top
R102  0  [R0805]  154.35,54.19 270 top
R103  0  [R0805]  150.19,54.16 270 top
R/L7  0  [R0805']  88.13,41.25 0 top
R/L8  0  [R0805']  93.13,41.25 180 top
R/L9  0  [R0805']  103.13,41.25 0 top
R/L10  0  [R0805']  108.13,41.25 180 top
R/L11  0  [R0805']  118.01,41.25 0 top
R/L12  0  [R0805']  123.01,41.25 180 top
R/L13  0  [R0805']  132.88,41.25 0 top
R/L14  0  [R0805']  137.88,41.25 180 top
REACT  [JP1]  153.87,157.93 0 top
RESET  [PBTH]  35.63,118 90 top
RF1  [TFM-110-02-SM-D-A-K]  64.67,168.67 180 top
RF2  [TFM-110-02-SM-D-A-K]  95.15,168.67 180 top
RS-232  [F09VP]  15.06,154.12 270 top
RX_EN  [JP1]  36.17,141.97 90 top
SV1  [JP2Q]  152.43,69.25 0 top
SV2  [MA05-1]  153.25,96.06 270 top
TVS1  SMAJ5.0CA  [DO214AC]  90.63,37.75 0 top
TVS2  SMAJ5.0CA  [DO214AC]  105.63,37.75 0 top
TVS3  SMAJ5.0CA  [DO214AC]  120.51,37.75 0 top
TVS4  SMAJ5.0CA  [DO214AC]  135.38,37.75 0 top
TX_EN  [JP1]  36.17,144.51 90 top
U1  PS8802  [SO08]  43.88,152.25 90 top
U2  PS8802  [SO08]  43.88,160 270 top
U3  TPS54060_DGQ_10  [DGQ10_1P88X1P57]  57.13,95 0 top
U$1  CUI_XR  [CUI_XR]  52.91,76.65 0 top
XT1  [CM200T]  133.63,77.75 270 top
ZD3  SMAJ5.0ABCT  [DO214AC]  80.76,84.5 180 top